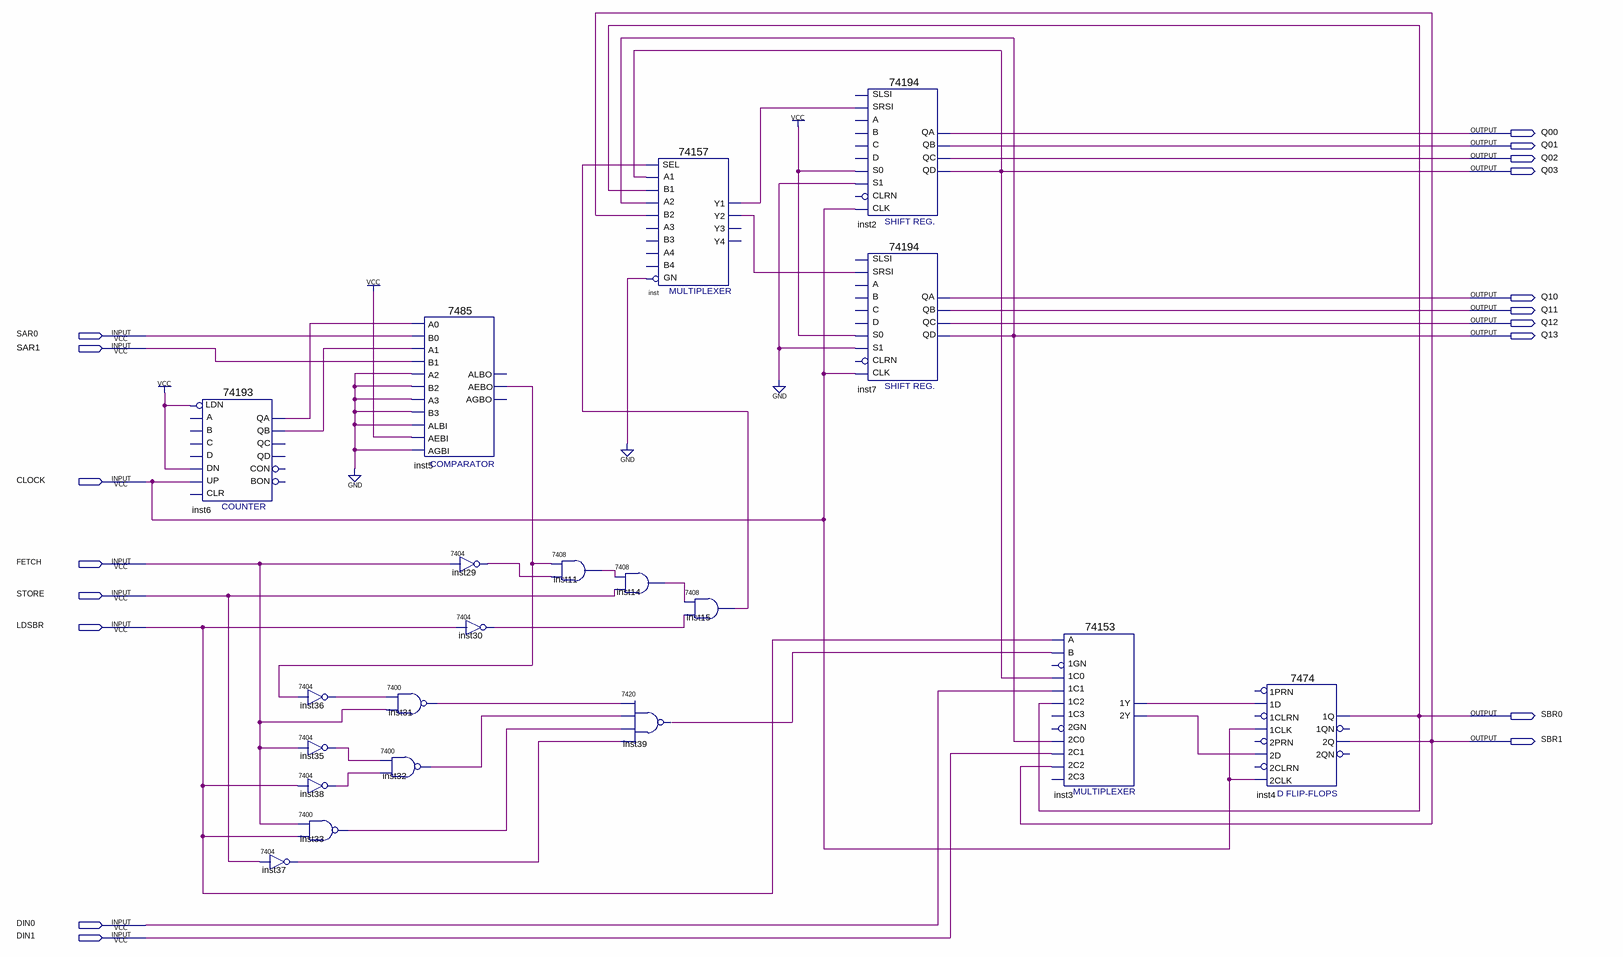
[diagram p0: schematic sheet]
// Quartus schematic Lab2.bdf as structural Verilog: 20 symbols, 18 pins
module Lab2 (
  input  SAR0,
  input  SAR1,
  input  CLOCK,
  input  FETCH,
  input  STORE,
  input  LDSBR,
  input  DIN0,
  input  DIN1,
  output Q00,
  output Q01,
  output Q02,
  output Q03,
  output Q10,
  output Q11,
  output Q12,
  output Q13,
  output SBR0,
  output SBR1
);

  wire inst3_1y, inst3_2y, inst5_aebo, inst6_qa, inst6_qb, inst11_1, inst14_1, inst15_1, inst29_1, inst30_1,
       inst31_1, inst32_1, inst33_1, inst35_1, inst36_1, inst37_1, inst38_1, inst39_1, inst_y1, inst_y2;

  \74193  inst6 (
    .UP(CLOCK), .DN(1'b1), .LDN(1'b1), .QB(inst6_qb), .QA(inst6_qa));  // open: D, C, B, A, CLR, CON, QD, QC, BON
  \7404  inst37 (.\2 (STORE), .\1 (inst37_1));
  \7404  inst36 (.\2 (inst5_aebo), .\1 (inst36_1));
  \7404  inst35 (.\2 (FETCH), .\1 (inst35_1));
  \7404  inst38 (.\2 (LDSBR), .\1 (inst38_1));
  \7400  inst33 (.\3 (LDSBR), .\2 (FETCH), .\1 (inst33_1));
  \7485  inst5 (
    .A3(1'b0), .B2(1'b0), .A2(1'b0), .AEBI(1'b1), .AGBI(1'b0), .ALBI(1'b0), .A0(inst6_qa), .B0(SAR0),
    .B3(1'b0), .A1(inst6_qb), .B1(SAR1), .AEBO(inst5_aebo));  // open: ALBO, AGBO
  \7400  inst31 (.\3 (FETCH), .\2 (inst36_1), .\1 (inst31_1));
  \7400  inst32 (.\3 (inst38_1), .\2 (inst35_1), .\1 (inst32_1));
  \7404  inst29 (.\2 (FETCH), .\1 (inst29_1));
  \7404  inst30 (.\2 (LDSBR), .\1 (inst30_1));
  \7408  inst11 (.\3 (inst29_1), .\2 (inst5_aebo), .\1 (inst11_1));
  \7408  inst14 (.\3 (STORE), .\2 (inst11_1), .\1 (inst14_1));
  \7420  inst39 (.\4 (inst33_1), .\2 (inst31_1), .\3 (inst32_1), .\5 (inst37_1), .\1 (inst39_1));
  \74157  inst (
    .A1(Q03), .B1(SBR0), .SEL(inst15_1), .B2(SBR1), .A2(Q13), .GN(1'b0), .Y2(inst_y2), .Y1(inst_y1));  // open: A3, B3, B4, A4, Y4, Y3
  \7408  inst15 (.\3 (inst30_1), .\2 (inst14_1), .\1 (inst15_1));
  \74194  inst2 (
    .SRSI(inst_y1), .CLK(CLOCK), .S1(1'b0), .S0(1'b1), .QA(Q00), .QB(Q01), .QC(Q02), .QD(Q03));  // open: SLSI, B, C, CLRN, D, A
  \74194  inst7 (
    .SRSI(inst_y2), .CLK(CLOCK), .S1(1'b0), .S0(1'b1), .QA(Q10), .QB(Q11), .QC(Q12), .QD(Q13));  // open: SLSI, B, C, CLRN, D, A
  \74153  inst3 (
    .\1C1 (DIN0), .\1C0 (Q03), .\2C0 (Q13), .\2C2 (SBR1), .\1C2 (SBR0), .B(inst39_1), .A(LDSBR),
    .\2C1 (DIN1), .\1Y (inst3_1y), .\2Y (inst3_2y));  // open: 1GN, 2GN, 1C3, 2C3
  \7474  inst4 (
    .\2D (inst3_2y), .\1CLK (CLOCK), .\1D (inst3_1y), .\2CLK (CLOCK), .\2Q (SBR1), .\1Q (SBR0));  // open: 2PRN, 1PRN, 2CLRN, 1CLRN, 1QN, 2QN
endmodule
